# EAGLE design pcb (EAGLE 7.4.0)
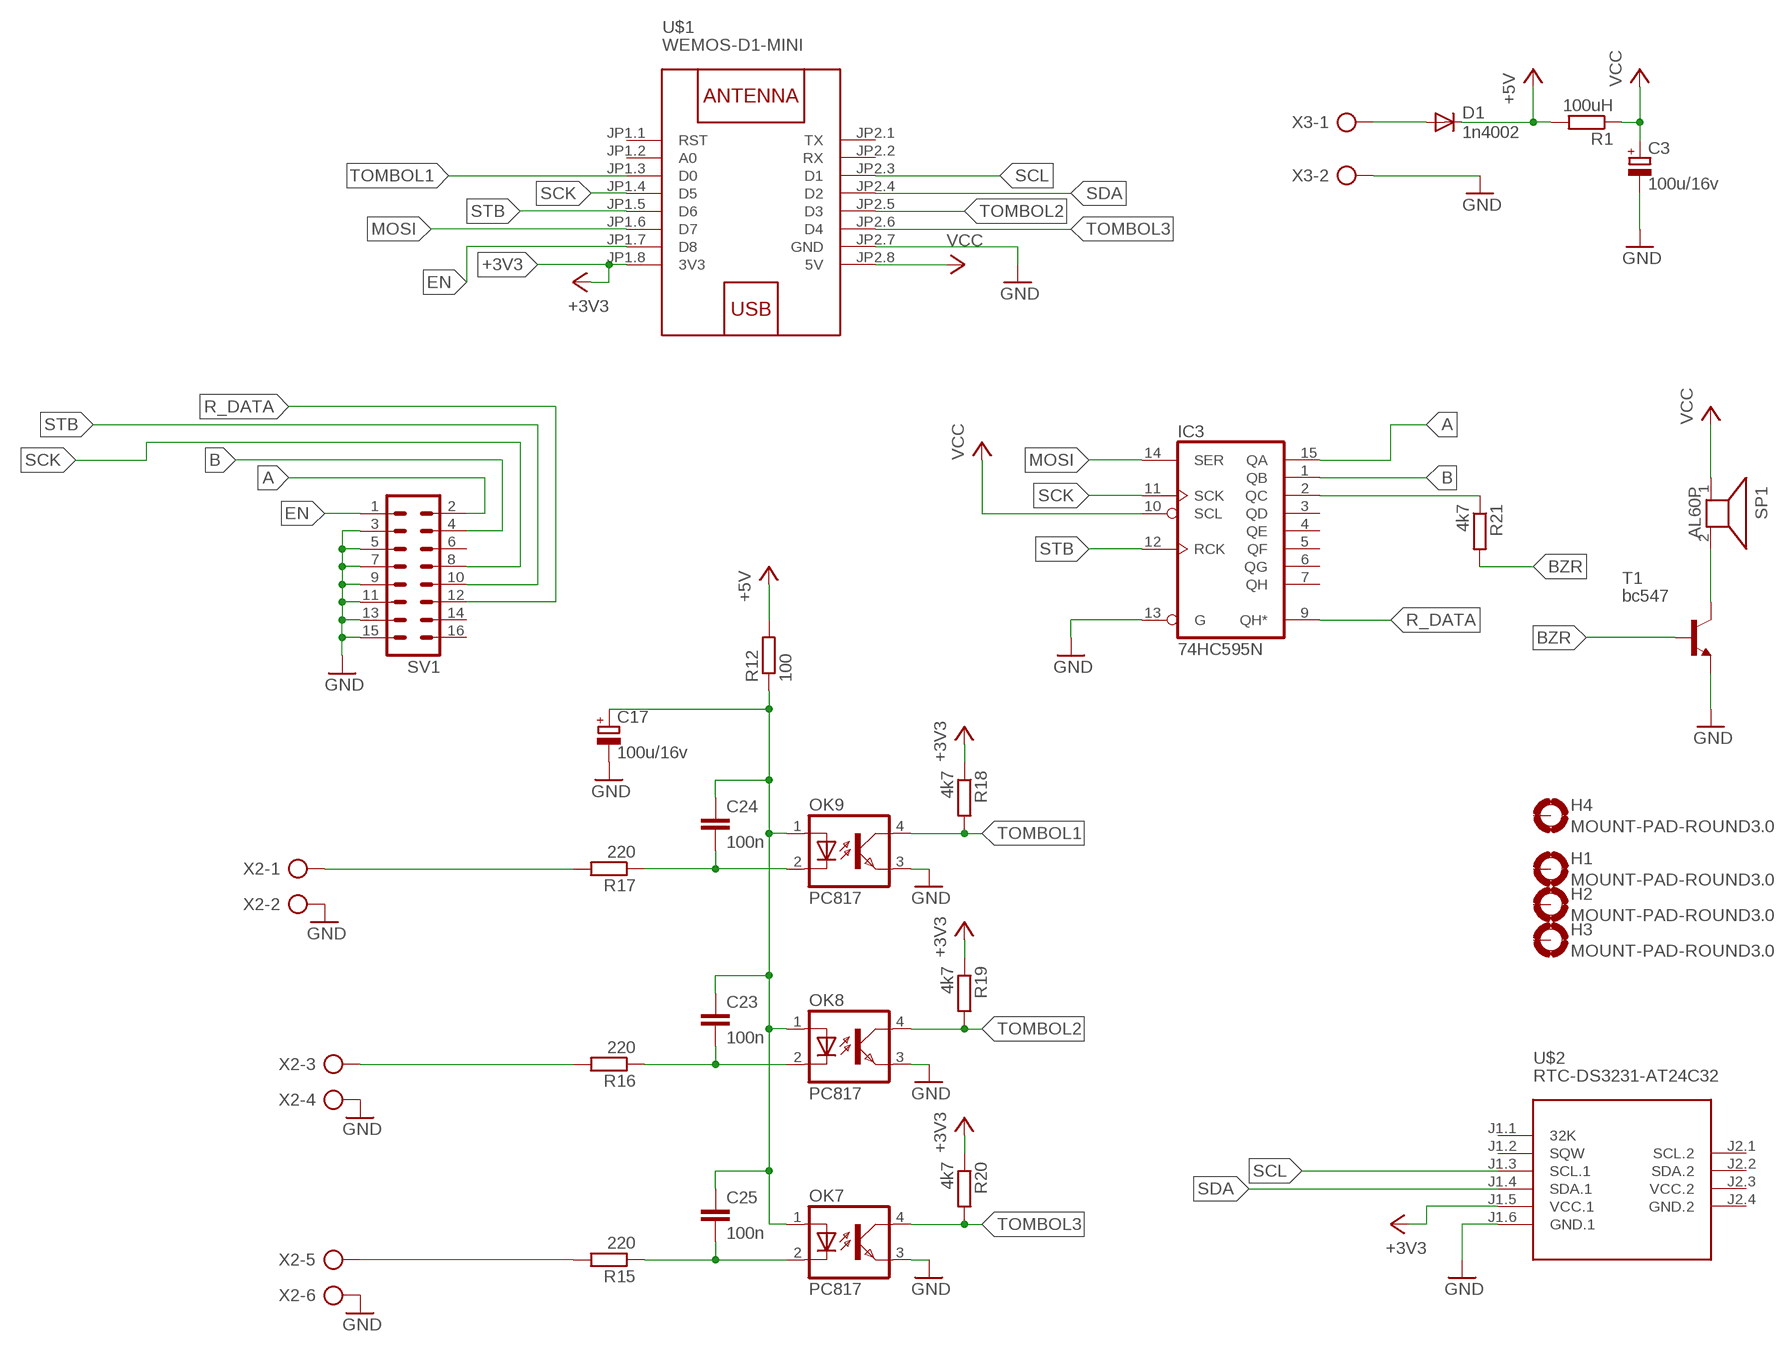
[diagram p0: schematic, sheet 1]

## Parts
C3  100u/16v  CPOL-EUE5-4  [E5-4]
C17  100u/16v  CPOL-EUE5-4  [E5-4]
C23  100n  C-EU050-025X075  [C050-025X075]
C24  100n  C-EU050-025X075  [C050-025X075]
C25  100n  C-EU050-025X075  [C050-025X075]
D1  1n4002  1N4446  [DO35-10]
H1  MOUNT-PAD-ROUND3.0  [3,0-PAD]
H2  MOUNT-PAD-ROUND3.0  [3,0-PAD]
H3  MOUNT-PAD-ROUND3.0  [3,0-PAD]
H4  MOUNT-PAD-ROUND3.0  [3,0-PAD]
IC3  74HC595N  [DIL16]
OK7  PC817  [DIL04]
OK8  PC817  [DIL04]
OK9  PC817  [DIL04]
R1  100uH  R-EU_0207/10  [0207/10]
R12  100  R-EU_0207/10  [0207/10]
R15  220  R-EU_0207/10  [0207/10]
R16  220  R-EU_0207/10  [0207/10]
R17  220  R-EU_0207/10  [0207/10]
R18  4k7  R-EU_0207/10  [0207/10]
R19  4k7  R-EU_0207/10  [0207/10]
R20  4k7  R-EU_0207/10  [0207/10]
R21  4k7  R-EU_0207/10  [0207/10]
SP1  AL60P  [AL60P]
SV1  ML16  [ML16]
T1  bc547  BC547A-NPN-TO92-CBE  [TO92-CBE]
U$1  WEMOS-D1-MINI  [WEMOS-D1-MINI]
U$2  RTC-DS3231-AT24C32  [RTC-DS3231-AT24C32]
X2  AK300/6  [AK300/6]
X3  AK300/2  [AK300/2]

## Nets
+3V3: R18.1 R19.1 R20.1 U$1.JP1.8(3V3) U$2.J1.5(VCC.1)
+5V: D1.C R1.2 R12.2
A: IC3.15(QA) SV1.2
B: IC3.1(QB) SV1.4
BZR: R21.2 T1.B
EN: SV1.1 U$1.JP1.7(D8)
GND: C3.- C17.- IC3.13(G) OK7.3(EMIT) OK8.3(EMIT) OK9.3(EMIT) SV1.3 SV1.5 SV1.7 SV1.9 SV1.11 SV1.13 SV1.15 T1.E U$1.JP2.7(GND) U$2.J1.6(GND.1) X2.2 X2.4 X2.6 X3.2
MOSI: IC3.14(SER) U$1.JP1.6(D7)
N$1: SP1.2 T1.C
N$25: D1.A X3.1
N$52: C24.2 OK9.2(C) R17.1
N$57: C25.2 OK7.2(C) R15.1
N$58: C23.2 OK8.2(C) R16.1
N$59: R15.2 X2.5
N$60: R16.2 X2.3
N$63: R17.2 X2.1
N$65: C17.+ C23.1 C24.1 C25.1 OK7.1(A) OK8.1(A) OK9.1(A) R12.1
N$69: IC3.2(QC) R21.1
R_DATA: IC3.9(QH*) SV1.12
SCK: IC3.11(SCK) SV1.8 U$1.JP1.4(D5)
SCL: U$1.JP2.3(D1) U$2.J1.3(SCL.1)
SDA: U$1.JP2.4(D2) U$2.J1.4(SDA.1)
STB: IC3.12(RCK) SV1.10 U$1.JP1.5(D6)
TOMBOL1: OK9.4(COL) R18.2 U$1.JP1.3(D0)
TOMBOL2: OK8.4(COL) R19.2 U$1.JP2.5(D3)
TOMBOL3: OK7.4(COL) R20.2 U$1.JP2.6(D4)
VCC: C3.+ IC3.10(SCL) R1.1 SP1.1 U$1.JP2.8(5V)
Unconnected: H1.B3,0(MOUNT) H2.B3,0(MOUNT) H3.B3,0(MOUNT) H4.B3,0(MOUNT) IC3.3(QD) IC3.4(QE) IC3.5(QF) IC3.6(QG) IC3.7(QH) SV1.6 SV1.14 SV1.16 U$1.JP1.1(RST) U$1.JP1.2(A0) U$1.JP2.1(TX) U$1.JP2.2(RX) U$2.J1.1(32K) U$2.J1.2(SQW) U$2.J2.1(SCL.2) U$2.J2.2(SDA.2)

## Power pins joined to a net without a drawn wire
GND: IC3.8(GND)
GND.2: U$2.J2.4(GND.2)
VCC: IC3.16(VCC)
VCC.2: U$2.J2.3(VCC.2)

## Library data of the parts
C3 C17 = rcl:CPOL-EU: POLARIZED CAPACITOR, European symbol
C23-C25 = rcl:C-EU: CAPACITOR, European symbol
D1 = diode:1N4446: DIODE high speed (Philips)
H1-H4 = holes:MOUNT-PAD-ROUND: MOUNTING PAD, round
IC3 = 74xx-eu:74*595: 8-bit SHIFT REGISTER, output latch
OK7-OK9 = optocoupler:PC817: SHARP OPTO COUPLER; MPN: PC817X4J000F; OC_FARNELL: 9707727; OC_NEWARK: 97K7059
R1 R12 R15-R21 = rcl2:R-EU_: RESISTOR, European symbol
SP1 = buzzer:AL60P: SPEAKER Source: Buerklin; OC_FARNELL: unknown; OC_NEWARK: unknown
SV1 = con-harting-ml:ML16: HARTING; OC_FARNELL: unknown; OC_NEWARK: unknown
T1 = transistor:*-NPN-: NPN Transistror BF959 corrected 2008.03.06
U$1 = libwmos:WEMOS-D1-MINI: WEMOS D1 mini: Mini Wi-Fi Board based on ESP-8266 device More details can be found here: https://www.wemos.cc/product/d1-mini.html Click here to find device on ebay.com <http://www.ebay.com/sch/wemos+d1+mini+nodemcu>
U$2 = diy-modules:RTC-DS3231-AT24C32: RTC Module with Battery and EEPROM based on DS3231 and AT24C32 chips Tutorial can be found here: https://edwardmallon.wordpress.com/2014/05/21/using-a-cheap-3-ds3231-rtc-at24c32-eeprom-from-ebay/ Click here to find device on ebay.com <http://www.ebay.com/sch/DS3231+AT24C32+module>
X2 = con-ptr500:AK300/6: CONNECTOR; OC_FARNELL: unknown; OC_NEWARK: unknown
X3 = con-ptr500:AK300/2: CONNECTOR; OC_FARNELL: unknown; OC_NEWARK: unknown

## Board
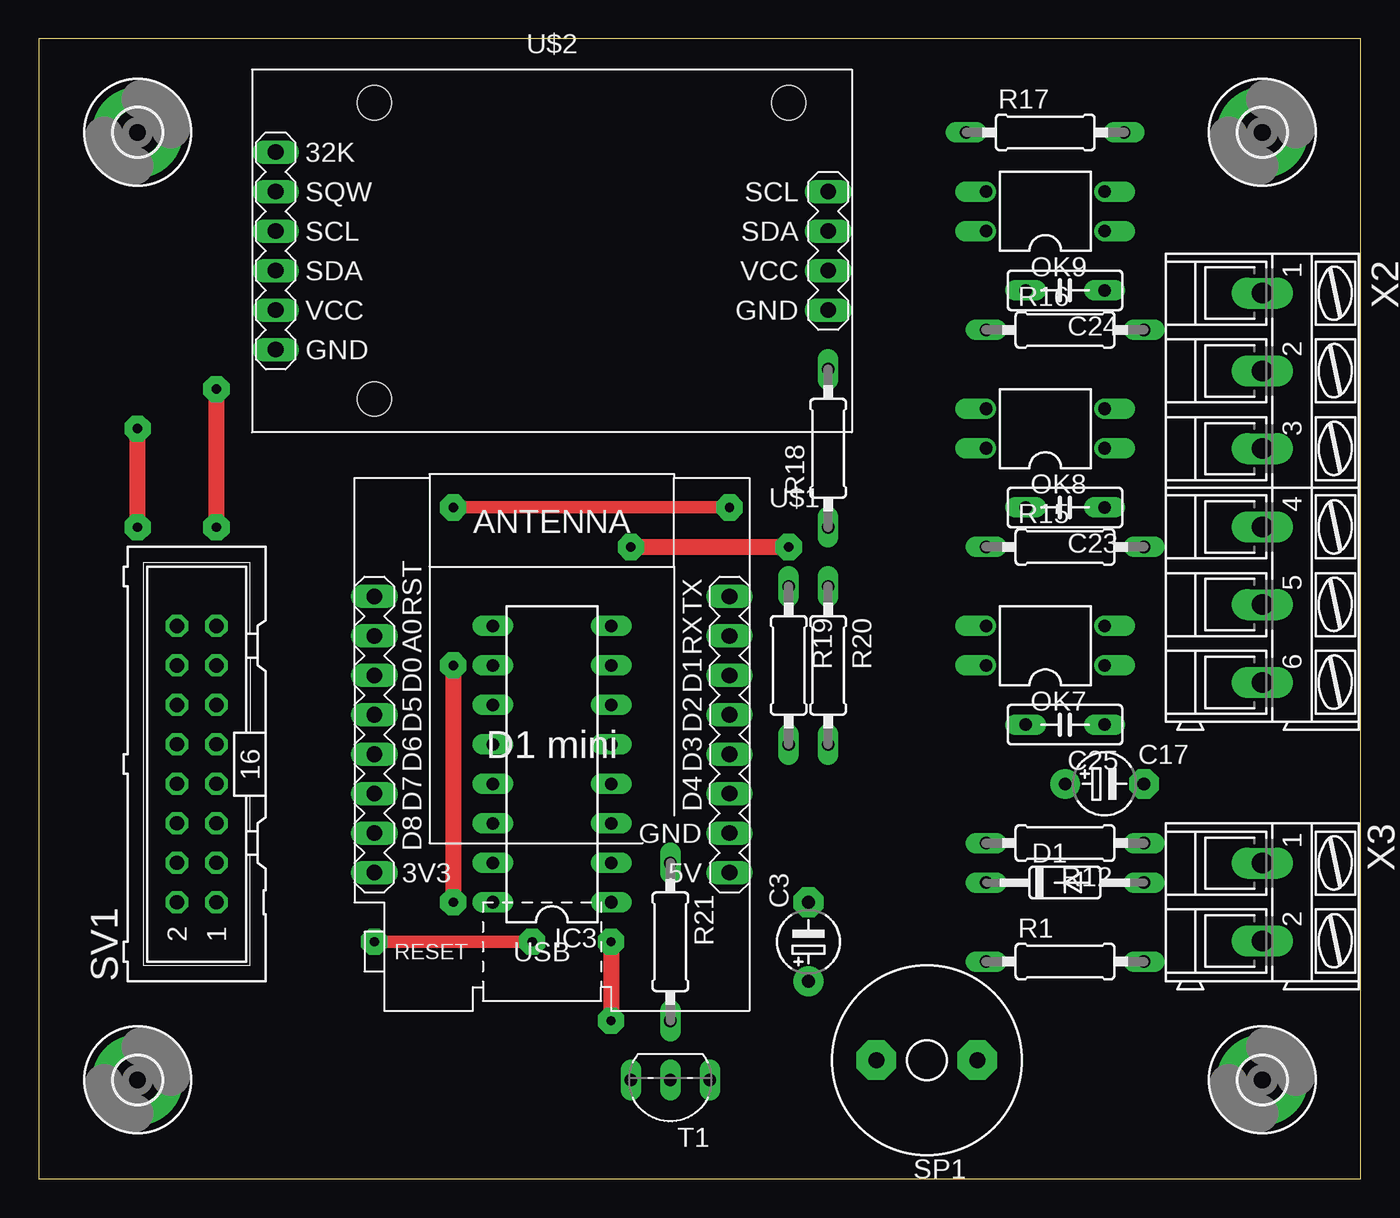
[diagram p1: board, top side]
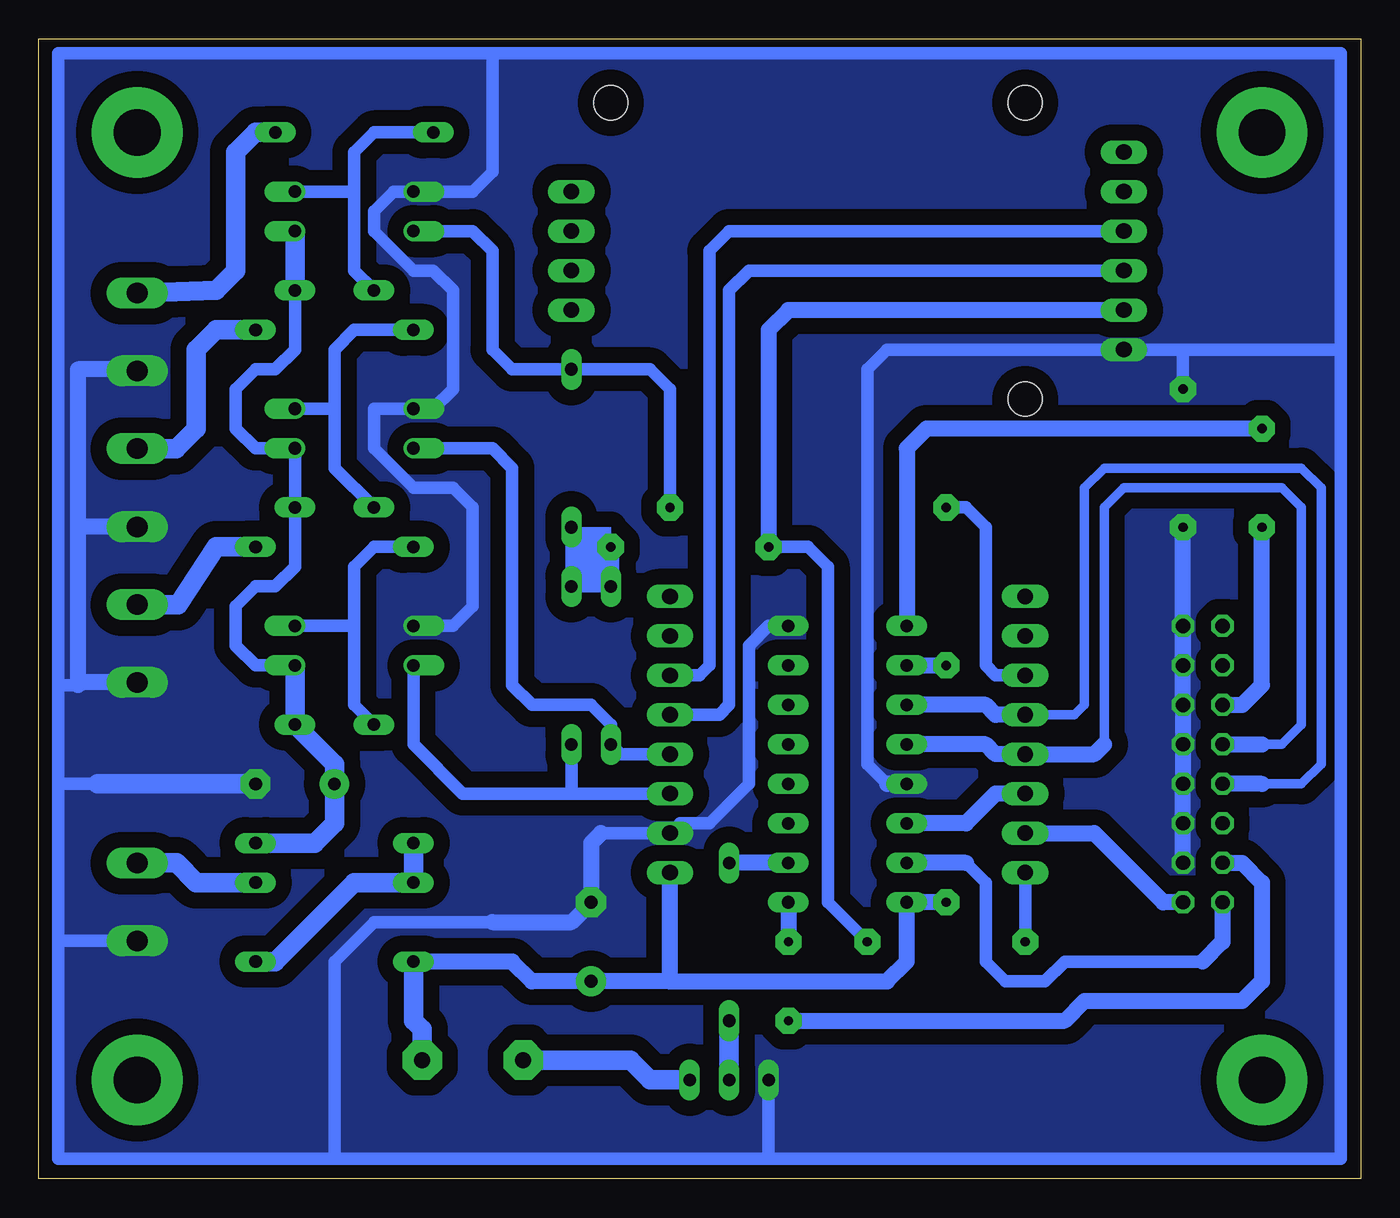
[diagram p2: board, bottom side, seen from below]

Size 85.07 x 73.33 mm. Coordinates in mm from the lower left corner, seen from the top.
Outline: 0,0 85.07,0 85.07,73.33 0,73.33 0,0
Copper layers (1*16): Top 0.035mm / dielectric 1.5mm / Bottom 0.035mm
Design rules "default": minimum track width 10mil, minimum drill 24mil, track to track 8mil, track to pad 8mil, pad to pad 8mil, via to via 8mil, smd to smd 8mil, copper to edge 40mil, drill to drill 8mil, minimum pad ring 10mil, minimum via ring 8mil, stop-mask expansion 4mil, vias tented up to drill 0mil, thermal gap 10mil

### Footprints (pad centres in the part's own frame; a part is rotated, then mirrored left to right if it is on the bottom)
E5-4 = drill 0.813 pad 1.905: + -2.54,0 | drill 0.813 pad 1.905 octagon: - 2.54,0
C050-025X075 = drill 0.813 long: 1 -2.54,0; 2 2.54,0
DO35-10 = drill 0.813 long: A 5.08,0; C -5.08,0
3,0-PAD = drill 3 pad 5.842: B3,0 0,0
DIL16 = drill 0.813 long: 1 -8.89,-3.81; 2 -6.35,-3.81; 3 -3.81,-3.81; 4 -1.27,-3.81; 5 1.27,-3.81; 6 3.81,-3.81; 7 6.35,-3.81; 8 8.89,-3.81; 9 8.89,3.81; 10 6.35,3.81; 11 3.81,3.81; 12 1.27,3.81; 13 -1.27,3.81; 14 -3.81,3.81; 15 -6.35,3.81; 16 -8.89,3.81
DIL04 = drill 0.813 offset: 1 -1.27,-3.81; 2 1.27,-3.81; 3 1.27,3.81; 4 -1.27,3.81
0207/10 = drill 0.813 long: 1 -5.08,0; 2 5.08,0
AL60P = drill 1.016 pad 2.54 octagon: 1 -3.251,0; 2 3.251,0
ML16 = drill 0.914 octagon: 1 -8.89,-1.27; 2 -8.89,1.27; 3 -6.35,-1.27; 4 -6.35,1.27; 5 -3.81,-1.27; 6 -3.81,1.27; 7 -1.27,-1.27; 8 -1.27,1.27; 9 1.27,-1.27; 10 1.27,1.27; 11 3.81,-1.27; 12 3.81,1.27; 13 6.35,-1.27; 14 6.35,1.27; 15 8.89,-1.27; 16 8.89,1.27
TO92-CBE = drill 0.813 long: B 0,0; C -2.54,0; E 2.54,0
WEMOS-D1-MINI = drill 1 long: JP1.1 -11.43,9.525; JP1.2 -11.43,6.985; JP1.3 -11.43,4.445; JP1.4 -11.43,1.905; JP1.5 -11.43,-0.635; JP1.6 -11.43,-3.175; JP1.7 -11.43,-5.715; JP1.8 -11.43,-8.255; JP2.1 11.43,9.525; JP2.2 11.43,6.985; JP2.3 11.43,4.445; JP2.4 11.43,1.905; JP2.5 11.43,-0.635; JP2.6 11.43,-3.175; JP2.7 11.43,-5.715; JP2.8 11.43,-8.255
RTC-DS3231-AT24C32 = drill 1 long: J1.1 -17.78,6.35; J1.2 -17.78,3.81; J1.3 -17.78,1.27; J1.4 -17.78,-1.27; J1.5 -17.78,-3.81; J1.6 -17.78,-6.35; J2.1 17.78,3.81; J2.2 17.78,1.27; J2.3 17.78,-1.27; J2.4 17.78,-3.81 | hole 2.2: -11.43,-9.525; -11.43,9.525; 15.24,9.525
AK300/6 = drill 1.321 long: 1 -12.522,0; 2 -7.518,0; 3 -2.515,0; 4 2.515,0; 5 7.518,0; 6 12.522,0
AK300/2 = drill 1.321 long: 1 -2.515,0; 2 2.489,0

### Placement (x,y rotation side)
C3  49.53,15.24 90 top
C17  68.58,25.4 0 top
C23  66.04,43.18 180 top
C24  66.04,57.15 180 top
C25  66.04,29.21 180 top
D1  66.04,19.05 0 top
H1  6.35,6.35 0 top
H2  6.35,67.31 0 top
H3  78.74,67.31 0 top
H4  78.74,6.35 0 top
IC3  33.02,26.67 90 top
OK7  64.77,34.29 90 top
OK8  64.77,48.26 90 top
OK9  64.77,62.23 90 top
R1  66.04,13.97 0 top
R12  66.04,21.59 180 top
R15  66.04,40.64 0 top
R16  66.04,54.61 0 top
R17  64.77,67.31 0 top
R18  50.8,46.99 90 top
R19  48.26,33.02 270 top
R20  50.8,33.02 270 top
R21  40.64,15.24 270 top
SP1  57.15,7.62 180 top
SV1  10.16,26.67 90 top
T1  40.64,6.35 180 top
U$1  33.02,27.94 0 top
U$2  33.02,59.69 0 top
X2  78.74,44.45 270 top
X3  78.74,17.78 270 top

### Tracks (layer width: path | path; a pad name or v marks a point on that pad's centre or on a via)
+3V3  (via drill 0.6 pad 1.68)
  Top 0.813: v31.75,15.24 v21.59,15.24
  Top 1.016: v38.1,40.64 v48.26,40.64
  Bottom 0.813: R19.1 R20.1 R18.1 | v38.1,40.64 35.56,40.64 34.29,39.37 34.29,17.78 v31.75,15.24 | v21.59,15.24 U$1.JP1.8
  Bottom 1.016: U$1.JP1.8 20.95,19.68 | U$2.J1.5 36.83,55.88 38.1,54.61 v38.1,40.64 | v48.26,40.64 R19.1
+5V
  Bottom 1.27: R12.2 D1.C 64.77,19.05 69.85,13.97 R1.2
A
  Bottom 0.813: 25.4,20.32 24.13,19.05 24.13,13.97 22.86,12.7 20.32,12.7 19.05,13.97 10.16,13.97
  Bottom 1.016: SV1.2 8.89,15.24 10.16,13.97 | 25.4,20.32 IC3.15
B  (via drill 0.6 pad 1.68)
  Top 1.016: v36.83,15.24 v36.83,10.16
  Bottom 1.016: SV1.4 7.62,20.32 6.35,19.05 6.35,12.7 7.62,11.43 17.78,11.43 19.05,10.16 v36.83,10.16 | IC3.1 v36.83,15.24
BZR
  Bottom 1.27: T1.B R21.2
EN
  Bottom 1.016: SV1.1 12.7,17.78 17.14,22.23 U$1.JP1.7
GND  (via drill 0.6 pad 1.68)
  Top 1.016: v11.43,41.91 v11.43,50.8
  Bottom 0.813: 1.27,53.34 1.27,1.27 38.1,1.27 | 38.1,1.27 66.04,1.27 | 66.04,1.27 83.82,1.27 83.82,15.24 | 83.82,15.24 83.82,25.4 | 83.82,25.4 83.82,31.75 | 83.82,31.75 83.82,72.39 55.88,72.39 | 55.88,72.39 1.27,72.39 1.27,53.34 | 11.43,53.34 U$2.J1.6 30.48,53.34 31.75,52.07 31.75,26.67 30.48,25.4 | 11.43,53.34 1.27,53.34 | v11.43,50.8 11.43,53.34 | X3.2 83.77,15.29 83.82,15.24 | 55.88,72.39 55.88,64.77 57.15,63.5 OK9.3 62.23,63.5 63.5,62.23 63.5,60.96 60.96,58.42 59.69,58.42 58.42,57.15 58.42,50.8 59.69,49.53 OK8.3 63.5,49.53 63.5,46.99 60.96,44.45 58.42,44.45 57.15,43.18 57.15,36.83 58.42,35.56 OK7.3 | 55.88,16.51 63.5,16.51 66.04,13.97 66.04,1.27 | 48.9,22.23 U$1.JP2.7 43.81,22.86 41.91,22.86 39.37,25.4 39.37,34.29 38.1,35.56 IC3.8 | C17.- 83.82,25.4 | 82.55,31.75 83.82,31.75 | T1.E 38.1,1.27
  Bottom 1.016: X2.4 82.53,41.94 82.55,41.91 | 82.55,41.91 82.55,52.07 78.84,52.07 X2.2 | X2.6 82.37,31.93 82.55,31.75 82.55,41.91 | IC3.13 30.48,25.4 | SV1.3 SV1.5 SV1.7 SV1.9 SV1.11 | SV1.15 SV1.13 SV1.11 | SV1.11 v11.43,41.91 | 55.88,16.51 50.8,16.51 C3.- 49.53,21.59 48.9,22.23
  Bottom 1.27: X3.2 78.74,15.24 | C17.- 81.28,25.4
  pour Bottom (isolate 1.016, no thermals): -1.27,73.66 86.36,74.93 86.36,-1.27 -1.27,-1.27
MOSI
  Bottom 1.016: U$1.JP1.6 23.5,24.77 25.4,22.86 IC3.14
N$1
  Bottom 1.27: SP1.2 46.99,7.62 45.72,6.35 T1.C
N$25
  Bottom 1.27: D1.A 74.93,19.05 76.2,20.32 78.72,20.32 X3.1
N$52
  Bottom 0.813: R17.1 63.5,67.31 64.77,66.04 64.77,63.5 | 64.77,63.5 64.77,58.42 C24.2 | OK9.2 64.77,63.5
N$57
  Bottom 0.813: R15.1 63.5,40.64 64.77,39.37 64.77,35.56 | 64.77,35.56 64.77,30.48 C25.2 | OK7.2 64.77,35.56
N$58
  Bottom 0.813: R16.1 64.77,54.61 66.04,53.34 66.04,49.53 | 66.04,49.53 66.04,45.72 C23.2 | OK8.2 66.04,49.53
N$59
  Bottom 1.27: X2.5 76.1,36.93 73.66,40.64 R15.2
N$60
  Bottom 1.27: X2.3 76.22,46.97 74.93,48.26 74.93,53.34 73.66,54.61 R16.2
N$63
  Bottom 1.27: R17.2 71.12,67.31 72.39,66.04 72.39,58.42 73.66,57.15 X2.1
N$65
  Bottom 0.813: OK7.1 71.12,33.02 72.39,34.29 72.39,36.83 71.12,38.1 69.85,38.1 68.58,39.37 C23.1 OK8.1 71.12,46.99 72.39,48.26 72.39,50.8 71.12,52.07 69.85,52.07 68.58,53.34 C24.1
  Bottom 1.27: OK9.1 C24.1 | OK7.1 C25.1 66.04,26.67 C17.+ 66.04,22.86 67.31,21.59 R12.1
N$69
  Bottom 1.016: IC3.2 R21.1
R_DATA  (via drill 0.6 pad 1.68)
  Top 1.016: v6.35,41.91 v6.35,48.26
  Bottom 1.016: SV1.12 7.62,30.48 6.35,31.75 v6.35,41.91 | IC3.9 29.21,46.99 27.94,48.26 v6.35,48.26
SCK
  Bottom 0.61: U$1.JP1.4 18.41,29.84 17.78,30.48 17.78,44.45 16.51,45.72 3.81,45.72 2.54,44.45 2.54,26.67 3.81,25.4 6.35,25.4
  Bottom 1.016: U$1.JP1.4 23.5,29.84 24.13,30.48 IC3.11 | 6.35,25.4 SV1.8
SCL
  Bottom 0.813: U$2.J1.3 40.64,60.96 41.91,59.69 41.91,33.02 42.55,32.38 U$1.JP2.3
SDA
  Bottom 0.813: U$2.J1.4 39.37,58.42 40.64,57.15 40.64,30.48 41.27,29.84 U$1.JP2.4
STB
  Bottom 0.61: 16.51,27.94 16.51,43.18 15.24,44.45 5.08,44.45 3.81,43.18 3.81,29.21 5.08,27.94 6.35,27.94
  Bottom 1.016: IC3.12 24.13,27.94 23.5,27.3 U$1.JP1.5 17.14,27.3 16.51,27.94 | SV1.10 6.35,27.94
TOMBOL1  (via drill 0.6 pad 1.68)
  Top 0.813: v26.67,43.18 v44.45,43.18
  Bottom 0.813: U$1.JP1.3 23.5,32.38 24.13,33.02 24.13,41.91 25.4,43.18 v26.67,43.18 | v44.45,43.18 44.45,50.8 45.72,52.07 R18.2 54.61,52.07 55.88,53.34 55.88,59.69 57.15,60.96 OK9.4
TOMBOL2
  Bottom 0.813: U$1.JP2.5 47.62,27.3 R19.2 48.26,29.21 49.53,30.48 53.34,30.48 54.61,31.75 54.61,45.72 55.88,46.99 OK8.4
TOMBOL3
  Bottom 0.813: U$1.JP2.6 50.8,24.77 | 50.8,24.77 57.78,24.77 60.96,27.94 OK7.4 | R20.2 50.8,24.77
VCC  (via drill 0.6 pad 1.68)
  Top 1.016: v26.67,33.02 v26.67,17.78
  Bottom 1.016: 44.45,12.7 30.48,12.7 29.21,13.97 IC3.16 v26.67,17.78 | 44.45,12.7 U$1.JP2.8 | IC3.10 v26.67,33.02 | 44.45,12.7 C3.+ 53.34,12.7 54.61,13.97 R1.1
  Bottom 1.27: SP1.1 60.4,9.6 60.96,10.16 R1.1
(copper drawn outside any net)
  shapes: Bottom area x2